# Altium schematic sheet Schema.SchDoc
size A3; Organization: Altium Limited; Address1: L3, 12a Rodborough Rd; Address2: Frenchs Forest; Address3: NSW; Address4: Australia 2086; PageSetup: Record=PageOptions|CenterHorizontal=True|CenterVertical=True|PrintScale=1.00|XCorrection=1.00|YCorrection=1.00|PrintKind=1|BorderSize=5000000|LeftOffset=0|BottomOffset=0|Orientation=2|PaperLength=1000|PaperWidth=1000|Scale=100|PaperSource=7|PrintQuality=-4|MediaType=1|DitherType=10|PaperKind=A3|PrintScaleMode=1
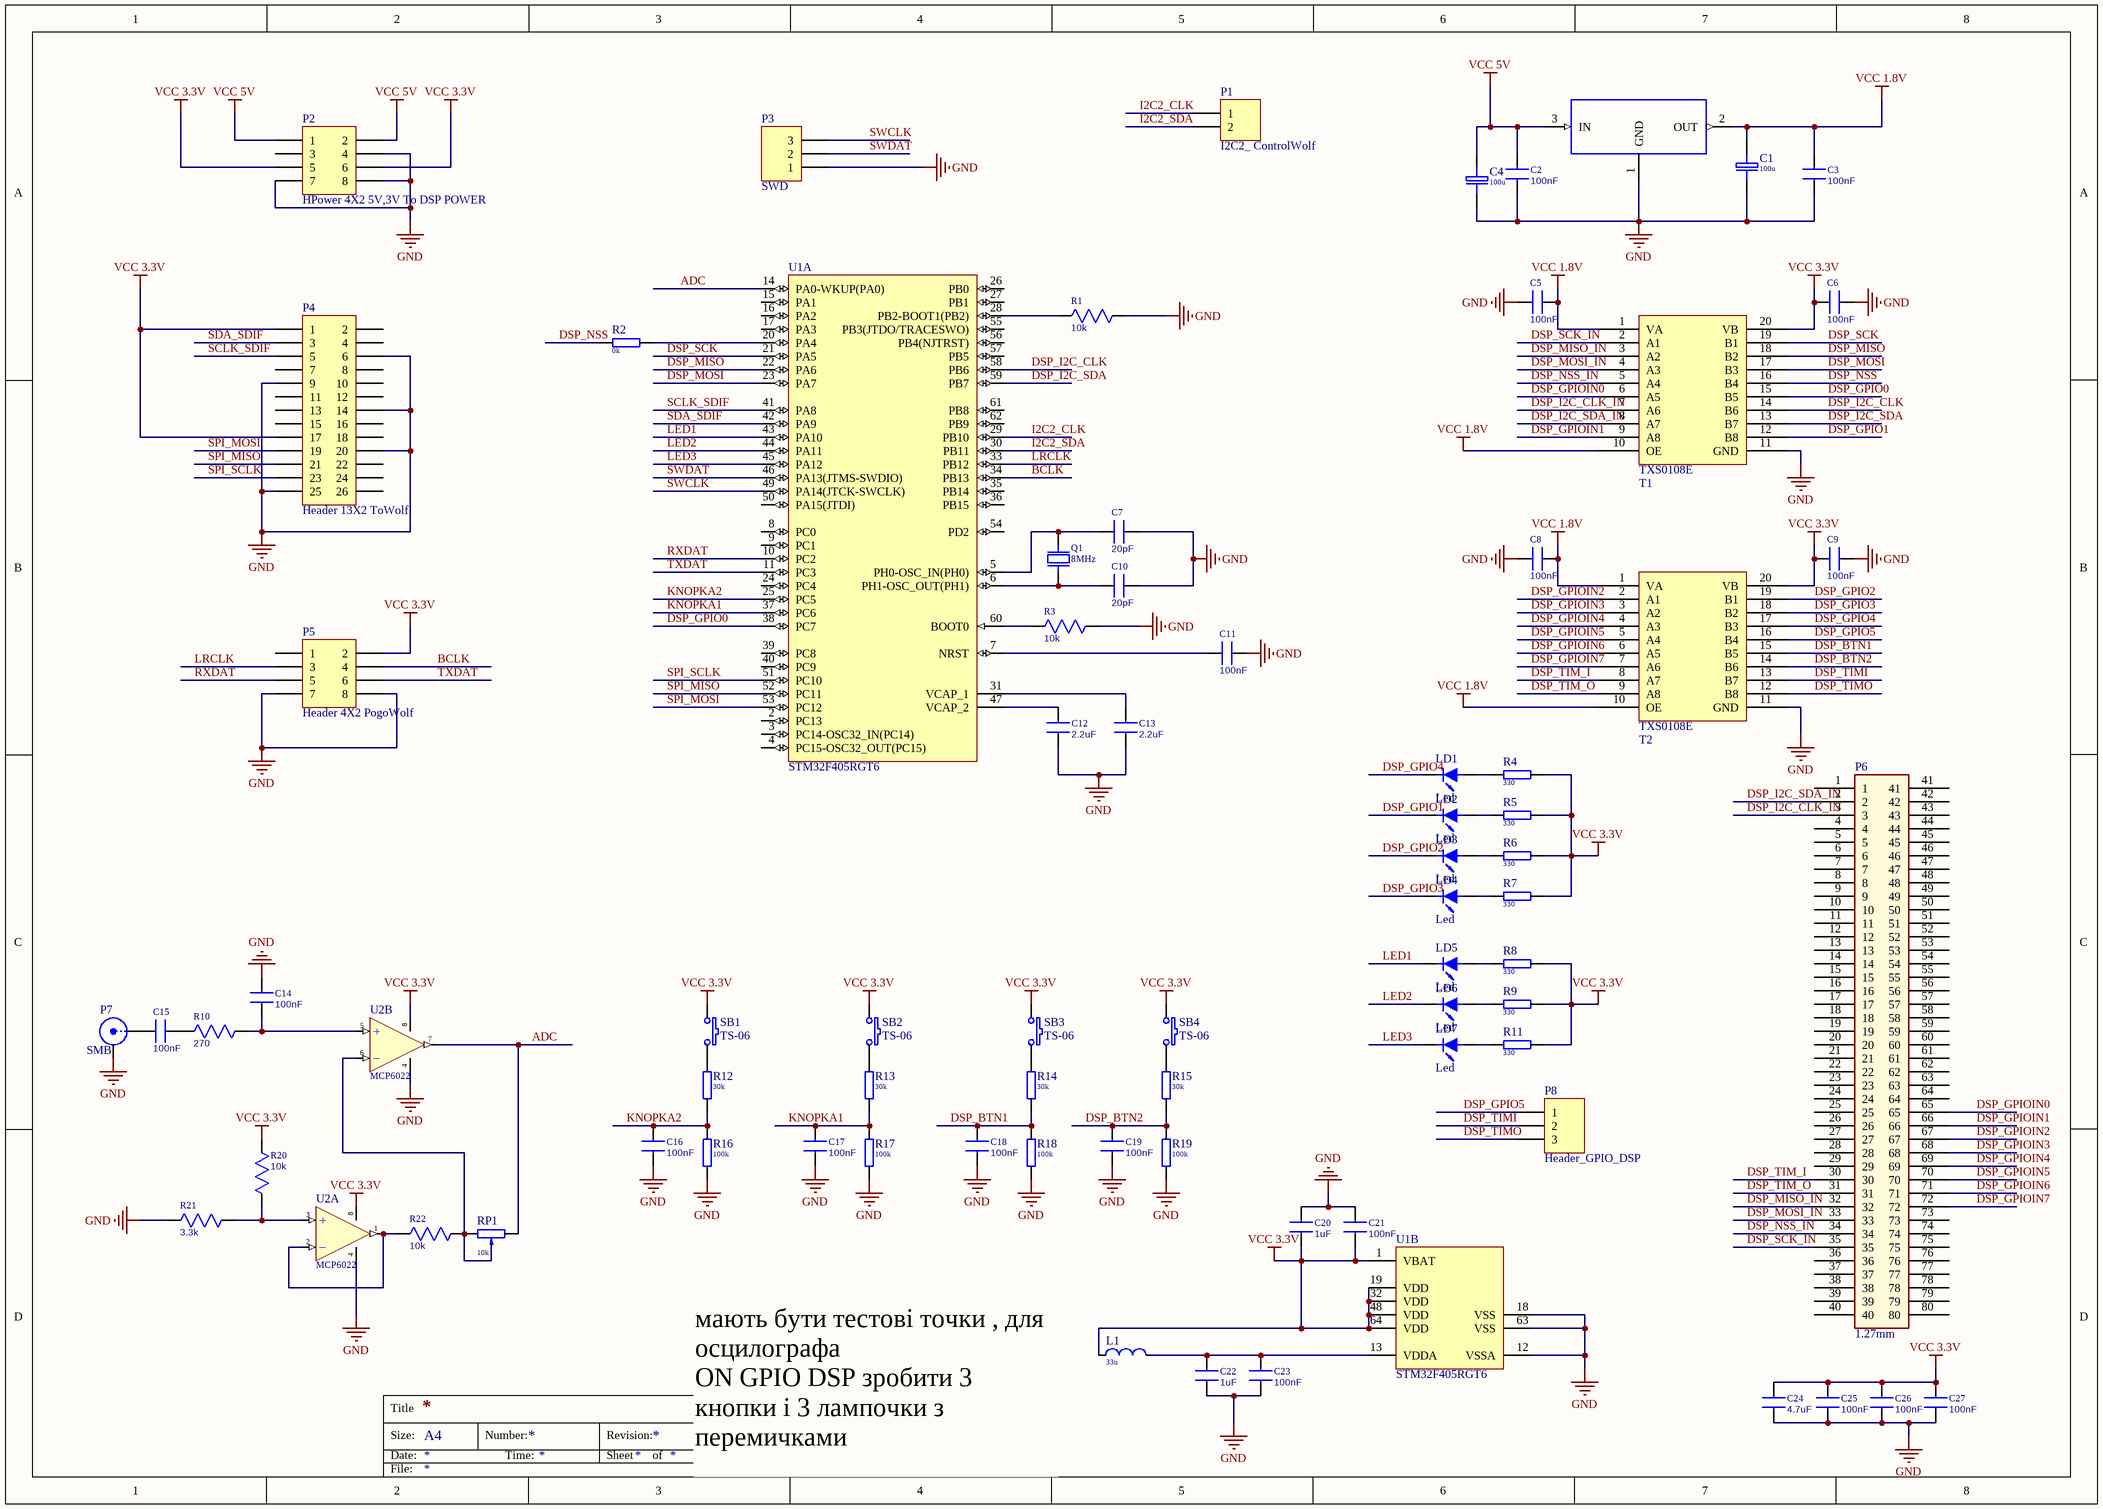
[diagram p0: Schema.SchDoc]

## Parts
1  AMS1117-1.8  [SOT-223_AMS1117-3.3(Primary)]  (value not drawn)
C1  100u  [El-d5-h11-F2.54]
C2  100nF  [C_0805]
C3  100nF  [C_0805]
C4  100u  [El-d5-h11-F2.54]
C5  100nF  [C_0805]
C6  100nF  [C_0805]
C7  20pF  [C_0805]
C8  100nF  [C_0805]
C9  100nF  [C_0805]
C10  20pF  [C_0805]
C11  100nF  [C_0805]
C12  2.2uF  [C_0805]
C13  2.2uF  [C_0805]
C14  100nF  [C_0805]
C15  100nF  [C_0805]
C16  100nF  [C_0805]
C17  100nF  [C_0805]
C18  100nF  [C_0805]
C19  100nF  [C_0805]
C20  1uF  [C_0805]
C21  100nF  [C_0805]
C22  1uF  [C_0805]
C23  100nF  [C_0805]
C24  4.7uF  [C_0805]
C25  100nF  [C_0805]
C26  100nF  [C_0805]
C27  100nF  [C_0805]
L1  33u  [Dr-SD-75]
LD1  Led  [Led d3mm Blue]
LD2  Led  [Led d3mm Blue]
LD3  Led  [Led d3mm Blue]
LD4  Led  [Led d3mm Blue]
LD5  Led  [Led d3mm Blue]
LD6  Led  [Led d3mm Blue]
LD7  Led  [Led d3mm Blue]
P1  I2C2_ ControlWolf  [HDR1X2]
P2  HPower 4X2 5V,3V To DSP POWER  [HDR2X4]
P3  SWD  [HDR1X3]
P4  Header 13X2 ToWolf  [HDR2X13]
P5  Header 4X2 PogoWolf  [HDR2X4]
P6  1.27mm  [1.27mm-80p]
P7  SMB  [SMB_V-RJ45]
P8  Header_GPIO_DSP  [HDR1X3]
Q1  8MHz  [HC49S]
R1  value 10k  [R_0805]  (hidden comment: 0)
R2  0k  [R0805]
R3  value 10k  [R_0805]  (hidden comment: 0)
R4  330  [R0805]
R5  330  [R0805]
R6  330  [R0805]
R7  330  [R0805]
R8  330  [R0805]
R9  330  [R0805]
R10  value 270  [R_0805]  (hidden comment: 0)
R11  330  [R0805]
R12  30k  [R0805]
R13  30k  [R0805]
R14  30k  [R0805]
R15  30k  [R0805]
R16  100k  [R0805]
R17  100k  [R0805]
R18  100k  [R0805]
R19  100k  [R0805]
R20  value 10k  [R_0805]  (hidden comment: 0)
R21  value 3.3k  [R_0805]  (hidden comment: 0)
R22  value 10k  [R_0805]  (hidden comment: 0)
RP1  10k  [R-Tr 6LV]
SB1  TS-06  [TS-06]
SB2  TS-06  [TS-06]
SB3  TS-06  [TS-06]
SB4  TS-06  [TS-06]
T1  Logic Level Converter  [TXS0108E]  (value not drawn)
T2  Logic Level Converter  [TXS0108E]  (value not drawn)
U1  STM32F405RGT6  [STM-LQFP64_N]  (parts A,B of 2)
U2  MCP6022  [SO8-150]  (parts A,B of 2)

## Nets
GND: 1.1(GND) C1.2 C2.1 C3.1 C4.2 C5.1 C6.2 C7.1 C8.1 C9.2 C10.1 C11.1 C12.1 C13.1 C14.1 C16.1 C17.1 C18.1 C19.1 C20.2 C21.2 C22.1 C23.1 C24.1 C25.1 C26.1 C27.1 P2.4 P2.7 P2.8 P3.1 P4.6 P4.9 P4.14 P4.20 P4.25 P5.7 P5.8 P7.2(Y) R1.1 R3.1 R16.2 R17.2 R18.2 R19.2 R21.1 T1.11(GND) T2.11(GND) U1.12(VSSA) U1.18(VSS) U1.63(VSS) U2.4(V-)
VCC 1.8V: 1.2(OUT) C1.1 C3.2 C5.2 C8.2 T1.1(VA) T1.10(OE) T2.1(VA) T2.10(OE)
VCC 3.3V: C6.1 C9.1 C20.1 C21.1 C24.2 C25.2 C26.2 C27.2 L1.1 P2.5 P2.6 P4.1 P4.17 P5.2 R4.1 R5.1 R6.1 R7.1 R8.1 R9.1 R11.1 R20.1 SB1.1 SB2.1 SB3.1 SB4.1 T1.20(VB) T2.20(VB) U1.1(VBAT) U1.19(VDD) U1.32(VDD) U1.48(VDD) U1.64(VDD) U2.8(V+)
VCC 5V: 1.3(IN) C2.2 C4.1 P2.1 P2.2
ADC: RP1.3 U1.14(PA0-WKUP(PA0)) U2.7(OUT)
BCLK: P5.4 U1.34(PB13)
DSP_BTN1: C18.2 R14.2 R18.1 T2.15(B5)
DSP_BTN2: C19.2 R15.2 R19.1 T2.14(B6)
DSP_GPIO0: T1.15(B5) U1.38(PC7)
DSP_GPIO1: LD2.2(K) T1.12(B8)
DSP_GPIO2: LD3.2(K) T2.19(B1)
DSP_GPIO3: LD4.2(K) T2.18(B2)
DSP_GPIO4: LD1.2(K) T2.17(B3)
DSP_GPIO5: P8.1 T2.16(B4)
DSP_GPIOIN0: P6.65 T1.6(A5)
DSP_GPIOIN1: P6.66 T1.9(A8)
DSP_GPIOIN2: P6.67 T2.2(A1)
DSP_GPIOIN3: P6.68 T2.3(A2)
DSP_GPIOIN4: P6.69 T2.4(A3)
DSP_GPIOIN5: P6.70 T2.5(A4)
DSP_GPIOIN6: P6.71 T2.6(A5)
DSP_GPIOIN7: P6.72 T2.7(A6)
DSP_I2C_CLK: T1.14(B6) U1.58(PB6)
DSP_I2C_CLK_IN: P6.3 T1.7(A6)
DSP_I2C_SDA: T1.13(B7) U1.59(PB7)
DSP_I2C_SDA_IN: P6.2 T1.8(A7)
DSP_MISO: T1.18(B2) U1.22(PA6)
DSP_MISO_IN: P6.32 T1.3(A2)
DSP_MOSI: T1.17(B3) U1.23(PA7)
DSP_MOSI_IN: P6.33 T1.4(A3)
DSP_NSS: R2.1 T1.16(B4)
DSP_NSS_IN: P6.34 T1.5(A4)
DSP_SCK: T1.19(B1) U1.21(PA5)
DSP_SCK_IN: P6.35 T1.2(A1)
DSP_TIM_I: P6.30 T2.8(A7)
DSP_TIM_O: P6.31 T2.9(A8)
DSP_TIMI: P8.2 T2.13(B7)
DSP_TIMO: P8.3 T2.12(B8)
I2C2_CLK: P1.1 U1.29(PB10)
I2C2_SDA: P1.2 U1.30(PB11)
KNOPKA1: C17.2 R13.2 R17.1 U1.37(PC6)
KNOPKA2: C16.2 R12.2 R16.1 U1.25(PC5)
LED1: LD5.2(K) U1.43(PA10)
LED2: LD6.2(K) U1.44(PA11)
LED3: LD7.2(K) U1.45(PA12)
LRCLK: P5.3 U1.33(PB12)
RXDAT: P5.5 U1.10(PC2)
SCLK_SDIF: P4.5 U1.41(PA8)
SDA_SDIF: P4.3 U1.42(PA9)
SPI_MISO: P4.21 U1.52(PC11)
SPI_MOSI: P4.19 U1.53(PC12)
SPI_SCLK: P4.23 U1.51(PC10)
SWCLK: P3.3 U1.49(PA14(JTCK-SWCLK))
SWDAT: P3.2 U1.46(PA13(JTMS-SWDIO))
TXDAT: P5.6 U1.11(PC3)
NetC7_2: C7.2 Q1.1 U1.5(PH0-OSC_IN(PH0))
NetC10_2: C10.2 Q1.2 U1.6(PH1-OSC_OUT(PH1))
NetC11_2: C11.2 U1.7(NRST)
NetC12_2: C12.2 U1.47(VCAP_2)
NetC13_2: C13.2 U1.31(VCAP_1)
NetC14_2: C14.2 R10.2 U2.5(+IN)
NetC15_1: C15.1 P7.1(X)
NetC15_2: C15.2 R10.1
NetC22_2: C22.2 C23.2 L1.2 U1.13(VDDA)
NetLD1_1: LD1.1(A) R4.2
NetLD2_1: LD2.1(A) R5.2
NetLD3_1: LD3.1(A) R6.2
NetLD4_1: LD4.1(A) R7.2
NetLD5_1: LD5.1(A) R8.2
NetLD6_1: LD6.1(A) R9.2
NetLD7_1: LD7.1(A) R11.2
NetR1_2: R1.2 U1.28(PB2-BOOT1(PB2))
NetR2_2: R2.2 U1.20(PA4)
NetR3_2: R3.2 U1.60(BOOT0)
NetR12_1: R12.1 SB1.2
NetR13_1: R13.1 SB2.2
NetR14_1: R14.1 SB3.2
NetR15_1: R15.1 SB4.2
NetR20_2: R20.2 R21.2 U2.3(+IN)
NetR22_1: R22.1 U2.1(OUT) U2.2(-IN)
NetR22_2: R22.2 RP1.1 RP1.2 U2.6(-IN)

Not connected (* = marked no-connect by the designer): P2 3; P4 2 4 7 8 10 11 12 13 15 16 18 22 24 26; P5 1; P6 1 4 5 6 7 8 9 10 11 12 13 14 15 16 17 18 19 20 21 22 23 24 25 26 27 28 29 36 37 38 39 40 41 42 43 44 45 46 47 48 49 50 51 52 53 54 55 56 57 58 59 60 61 62 63 64 73 74 75 76 77 78 79 80; U1 2(PC13) 3(PC14-OSC32_IN(PC14)) 4(PC15-OSC32_OUT(PC15)) 8(PC0) 9(PC1) 15(PA1) 16(PA2) 17(PA3) 24(PC4) 26(PB0) 27(PB1) 35(PB14) 36(PB15) 39(PC8) 40(PC9) 50(PA15(JTDI)) 54(PD2) 55(PB3(JTDO/TRACESWO)) 56(PB4(NJTRST)) 57(PB5) 61(PB8) 62(PB9)

## Notes on the sheet
- (near L1) мають бути тестові точки , для осцилографа
  ON GPIO DSP зробити 3 кнопки і 3 лампочки з перемичками
- Title
- Size:
- Date:
- A4
- Number:
- Time:
- Revision:
- Sheet
- of
- File:

## Library data of the parts
1 = AMS1117-3.3: Value: *
C1 C4 = 10u-35V: 35V; Price: 0.04; Value: 100u
C2 C3 C5-C27 = C0805: Capacitor
  C2 C3 C5 C6 C8 C9 C11 C14-C19 C21 C23 C25-C27: Value: 100nF
  C7 C10: Value: 20pF
  C12 C13: Value: 2.2uF
  C20 C22: Value: 1uF
  C24: Value: 4.7uF
L1 = L-SD-75 33uH: 1.2A 0.15om 7.3x7.3x5mm; Price: 0.85; Value: 33u
LD1-LD7 = Led 3mm Blue: 3mm; Price: 0.05
P1 = Header 2: Header, 2-Pin; LatestRevisionDate: 17-Jul-2002; LatestRevisionNote: Re-released for DXP Platform.; Publisher: Altium Limited
P2 P5 = Header 4X2: Header, 4-Pin, Dual row; LatestRevisionDate: 17-Jul-2002; LatestRevisionNote: Re-released for DXP Platform.; Publisher: Altium Limited
P3 P8 = Header 3: Header, 3-Pin; LatestRevisionDate: 17-Jul-2002; LatestRevisionNote: Re-released for DXP Platform.; Publisher: Altium Limited
P4 = Header 13X2: Header, 13-Pin, Dual row; LatestRevisionDate: 17-Jul-2002; LatestRevisionNote: Re-released for DXP Platform.; Publisher: Altium Limited
P6 = 1.27mm Header
P7 = SMB: SMB Straight Connector; LatestRevisionDate: 17-Jul-2002; LatestRevisionNote: Re-released for DXP Platform.; Publisher: Altium Limited
Q1 = Q: Typ: Qvarz 8 HC49S; Price: 0.45
R1 R3 R10 R20-R22 = R0805: Resistor
R2 R4-R9 R11-R19 = R-0805: SMD 0805 0.1W 5% 150V; Price: 0.017
  R2: Value: 0k
  R4-R9 R11: Value: 330
  R12-R15: Value: 30k
  R16-R19: Value: 100k
RP1 = R-Tr 6LV: Тример 0,15W 6mm Вер. Piner; Set Position: 0.5; Price: 0.2; Value: 10k
SB1-SB4 = Buton TS-06: Price: 0.15
T1 T2 = TXS0108E
U1 = STM32F405RGT6: ARM Cortex-M4 32-bit MCU+FPU, 210 DMIPS, 1024 kB Flash, 192 kB Internal RAM, 51 I/Os, 64-pin LQFP, -40 to 85 degC, Tray; Manufacturer: STMicroelectronics; D/A Converter: 2x12-bit; FLASH Size (Prog) (kB): 1024; I/Os (High Current): 51; Internal RAM Size (kB): 192; Operating Frequency(F) (Processor speed) (MHz): 168; Supply Voltage(Vcc) max (V): 3.6; Supply Voltage(Vcc) min (V): 1.8; DatasheetVersion: Rev. 4; PackageVersion: Rev. 4, 06/2013; PackageReference: LQFP64; PackageDescription: 64-Pin Low Profile Quad Flat Package, 10 x 10 mm Body, 0.5 mm Pitch; Supplier 1: Digi-Key; Supplier Part Number 1: 497-11767-ND; Supplier 2: Farnell; Supplier Part Number 2: 2064363; Supplier 3: Newark; Supplier Part Number 3: 73T2329; Supplier 4: Mouser; Supplier Part Number 4: 511-STM32F405RGT6; Core: ARM Cortex-M4; Packing: Tray; Mounting Technology: Surface Mount; PartNumber: STM32F405RGT6; ComponentLink1Description: Manufacturer URL; ComponentLink1URL: http://www.st.com/web/en/home.html; ComponentLink2Description: Datasheet; ComponentLink2URL: http://www.st.com/st-web-ui/static/active/en/resource/technical/document/datasheet/DM00037051.pdf; ComponentLink3Description: Package Specification; ComponentLink3URL: http://www.st.com/st-web-ui/static/active/en/resource/technical/document/datasheet/DM00037051.pdf
U2 = MCP6072: CMOS 0.15mV 1.2MHz R/R In/Out 110uA; Price: 1.25